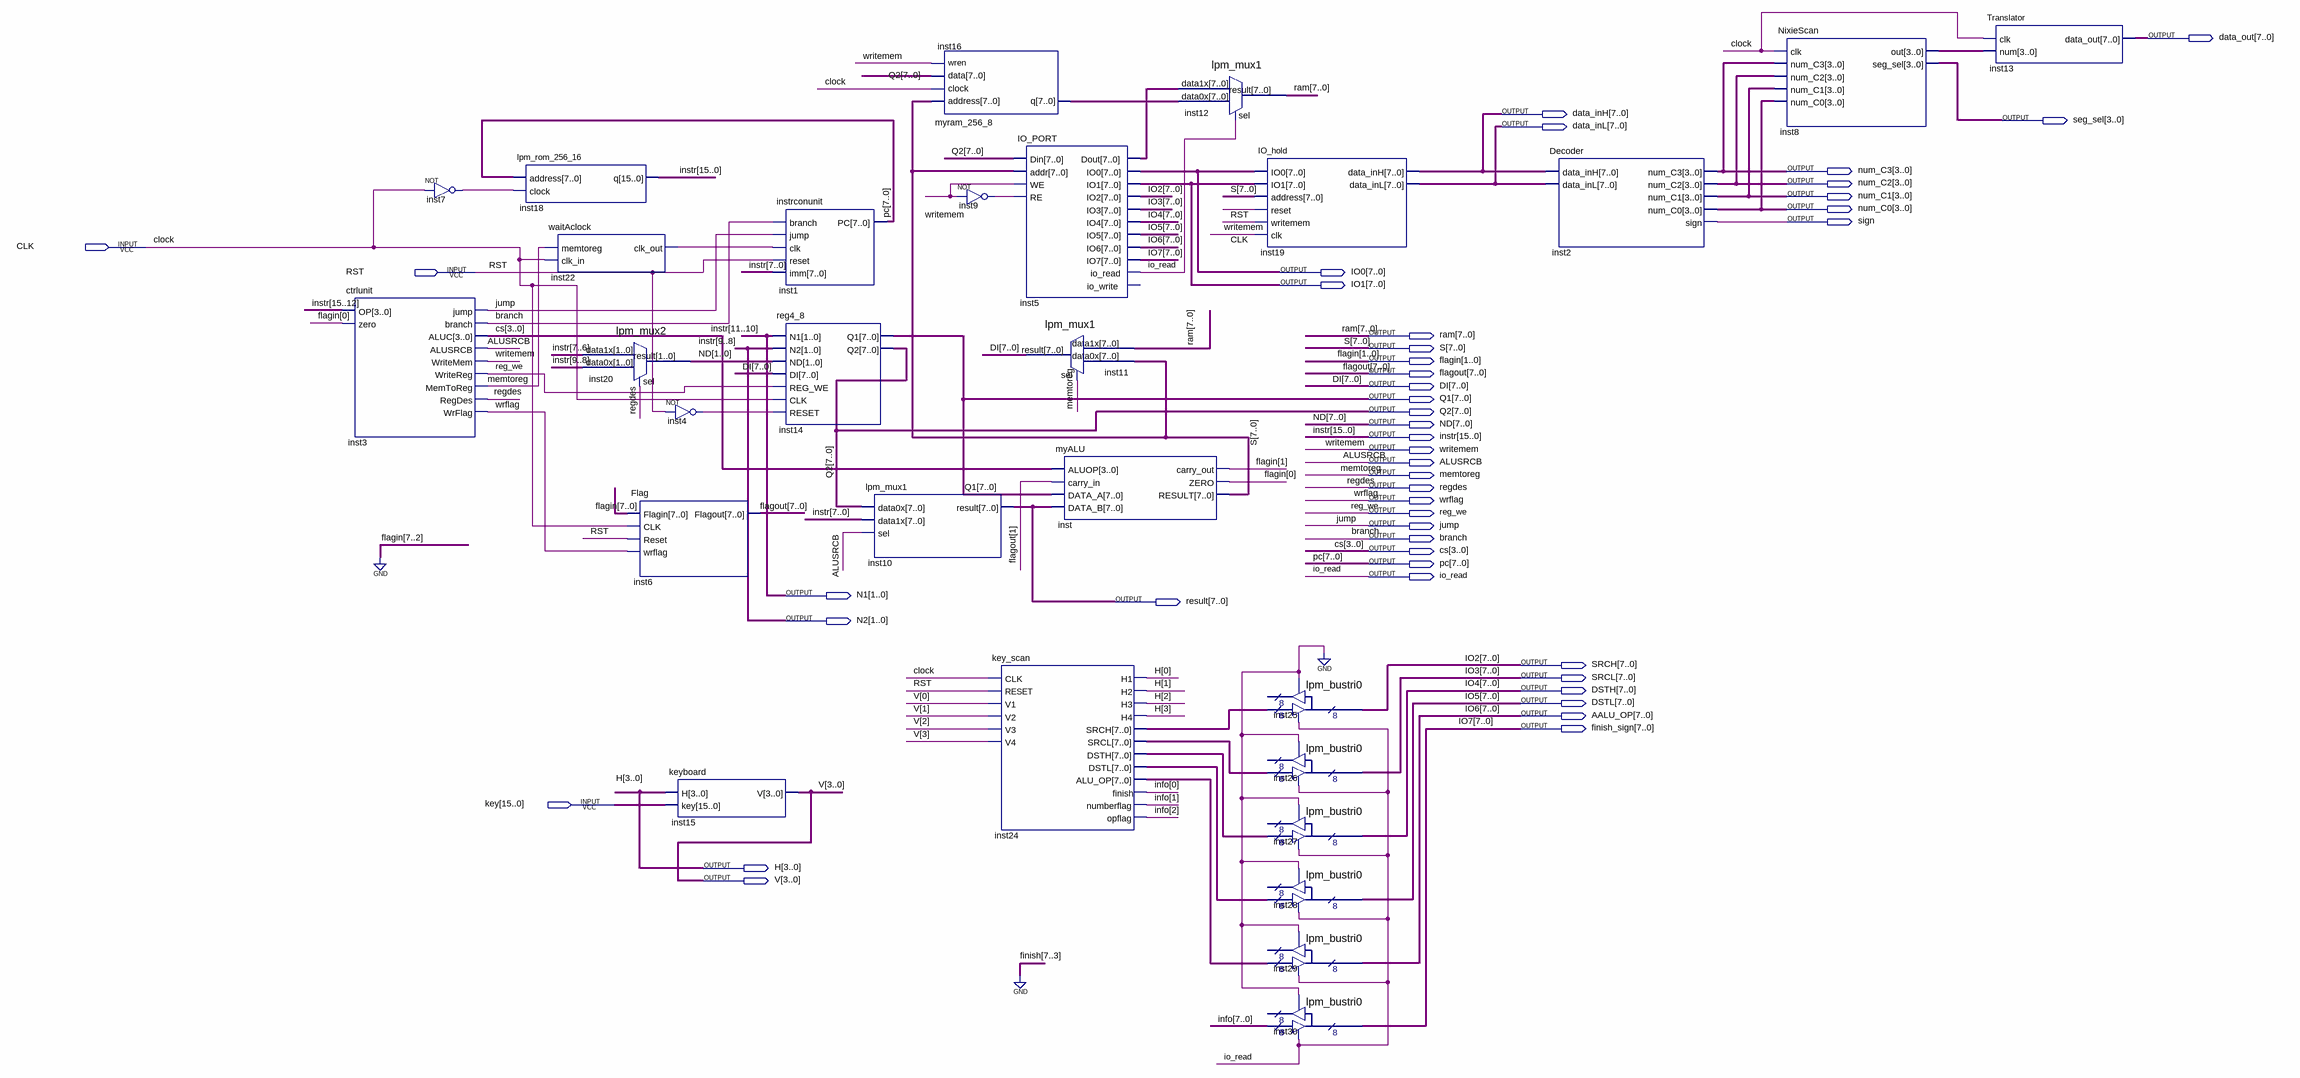
[diagram p0: schematic sheet]
// Quartus schematic systemC.bdf as structural Verilog: 28 symbols, 45 pins
module systemC (
  input  CLK,
  input  RST,
  input  [15:0] key,
  output [7:0] data_out,
  output [7:0] data_inH,
  output [3:0] seg_sel,
  output [7:0] data_inL,
  output [3:0] num_C3,
  output [3:0] num_C2,
  output [3:0] num_C1,
  output [3:0] num_C0,
  output sign,
  output [7:0] IO0,
  output [7:0] IO1,
  output [7:0] ram,
  output [7:0] S,
  output [1:0] flagin,
  output [7:0] flagout,
  output [7:0] DI,
  output [7:0] Q1,
  output [7:0] Q2,
  output [7:0] ND,
  output [15:0] instr,
  output writemem,
  output ALUSRCB,
  output memtoreg,
  output regdes,
  output wrflag,
  output reg_we,
  output jump,
  output branch,
  output [3:0] cs,
  output [7:0] pc,
  output io_read,
  output [1:0] N1,
  output [7:0] result,
  output [1:0] N2,
  output [7:0] SRCH,
  output [7:0] SRCL,
  output [7:0] DSTH,
  output [7:0] DSTL,
  output [7:0] AALU_OP,
  output [7:0] finish_sign,
  output [3:0] H,
  output [3:0] V
);

  wire inst4_out, inst7_out, inst9_out, inst22_clk_out;
  wire [3:0] inst8_out;
  wire [7:0] info, inst5_dout, inst16_q, inst24_alu_op, inst24_dsth, inst24_dstl, inst24_srch, inst24_srcl;

  ctrlunit inst3 (
    .OP(instr[15:12]), .zero(flagin[0]), .jump(jump), .branch(branch), .ALUC(cs), .ALUSRCB(ALUSRCB),
    .WriteMem(writemem), .WriteReg(reg_we), .MemToReg(memtoreg), .RegDes(regdes), .WrFlag(wrflag));
  not inst7 (inst7_out, CLK);
  lpm_rom_256_16 inst18 (.address(pc), .clock(inst7_out), .q(instr));
  waitAclock inst22 (.memtoreg(memtoreg), .clk_in(CLK), .clk_out(inst22_clk_out));
  lpm_mux2 inst20 (.data1x(instr[7:6]), .data0x(instr[9:8]), .sel(regdes), .result(ND[1:0]));
  Flag inst6 (.Flagin({{6{1'b0}}, flagin}), .CLK(CLK), .Reset(RST), .wrflag(wrflag), .Flagout(flagout));
  not inst4 (inst4_out, RST);
  keyboard inst15 (.H(H), .key(key), .V(V));
  instrconunit inst1 (.branch(branch), .jump(jump), .clk(inst22_clk_out), .reset(RST), .imm(instr[7:0]), .PC(pc));
  reg4_8 inst14 (
    .N2(instr[9:8]), .ND(ND[1:0]), .REG_WE(reg_we), .DI(DI), .CLK(CLK), .RESET(inst4_out), .N1(instr[11:10]),
    .Q2(Q2), .Q1(Q1));
  lpm_mux1 inst10 (.data0x(Q2), .data1x(instr[7:0]), .sel(ALUSRCB), .result(result));
  myram_256_8 inst16 (.address(S), .clock(CLK), .data(Q2), .wren(writemem), .q(inst16_q));
  not inst9 (inst9_out, writemem);
  key_scan inst24 (
    .CLK(CLK), .RESET(RST), .V1(V[0]), .V2(V[1]), .V3(V[2]), .V4(V[3]), .H1(H[0]), .H2(H[1]), .H3(H[2]),
    .H4(H[3]), .SRCH(inst24_srch), .SRCL(inst24_srcl), .DSTH(inst24_dsth), .DSTL(inst24_dstl),
    .ALU_OP(inst24_alu_op), .finish(info[0]), .numberflag(info[1]), .opflag(info[2]));
  IO_PORT inst5 (
    .Din(Q2), .addr(S), .WE(writemem), .RE(inst9_out), .Dout(inst5_dout), .io_read(io_read), .IO0(IO0),
    .IO1(IO1), .IO2(SRCH), .IO3(SRCL), .IO4(DSTH), .IO5(DSTL), .IO6(AALU_OP), .IO7(finish_sign));  // open: io_write
  lpm_mux1 inst11 (.data1x(ram), .data0x(S), .sel(memtoreg), .result(DI));
  myALU inst (
    .ALUOP(cs), .carry_in(flagout[1]), .DATA_A(Q1), .DATA_B(result), .carry_out(flagin[1]), .ZERO(flagin[0]),
    .RESULT(S));
  lpm_mux1 inst12 (.data1x(inst5_dout), .data0x(inst16_q), .sel(io_read), .result(ram));
  IO_hold inst19 (
    .IO0(IO0), .IO1(IO1), .address(S), .reset(RST), .writemem(writemem), .clk(CLK), .data_inH(data_inH),
    .data_inL(data_inL));
  lpm_bustri0 inst25 (.enabledt(io_read), .data(inst24_srch), .enabletr(1'b0), .tridata(SRCH));  // open: result
  lpm_bustri0 inst26 (.enabledt(io_read), .data(inst24_srcl), .enabletr(1'b0), .tridata(SRCL));  // open: result
  lpm_bustri0 inst27 (.enabledt(io_read), .data(inst24_dsth), .enabletr(1'b0), .tridata(DSTH));  // open: result
  lpm_bustri0 inst28 (.enabledt(io_read), .data(inst24_dstl), .enabletr(1'b0), .tridata(DSTL));  // open: result
  lpm_bustri0 inst29 (.enabledt(io_read), .data(inst24_alu_op), .enabletr(1'b0), .tridata(AALU_OP));  // open: result
  lpm_bustri0 inst30 (.enabledt(io_read), .data(info), .enabletr(1'b0), .tridata(finish_sign));  // open: result
  Decoder inst2 (
    .data_inH(data_inH), .data_inL(data_inL), .num_C3(num_C3), .num_C2(num_C2), .num_C1(num_C1),
    .num_C0(num_C0), .sign(sign));
  NixieScan inst8 (
    .clk(CLK), .num_C3(num_C3), .num_C2(num_C2), .num_C1(num_C1), .num_C0(num_C0), .out(inst8_out),
    .seg_sel(seg_sel));
  Translator inst13 (.clk(CLK), .num(inst8_out), .data_out(data_out));

  assign N1 = instr[11:10];
  assign N2 = instr[9:8];

  // Other names for the same wires on the sheet: clock = CLK; IO2[7:0] = SRCH; IO3[7:0] = SRCL; IO4[7:0] = DSTH;
  //   IO5[7:0] = DSTL; IO6[7:0] = AALU_OP; IO7[7:0] = finish_sign
endmodule
